# EAGLE design Trampoline_Light_Control_Breakout (EAGLE 6.5.0)
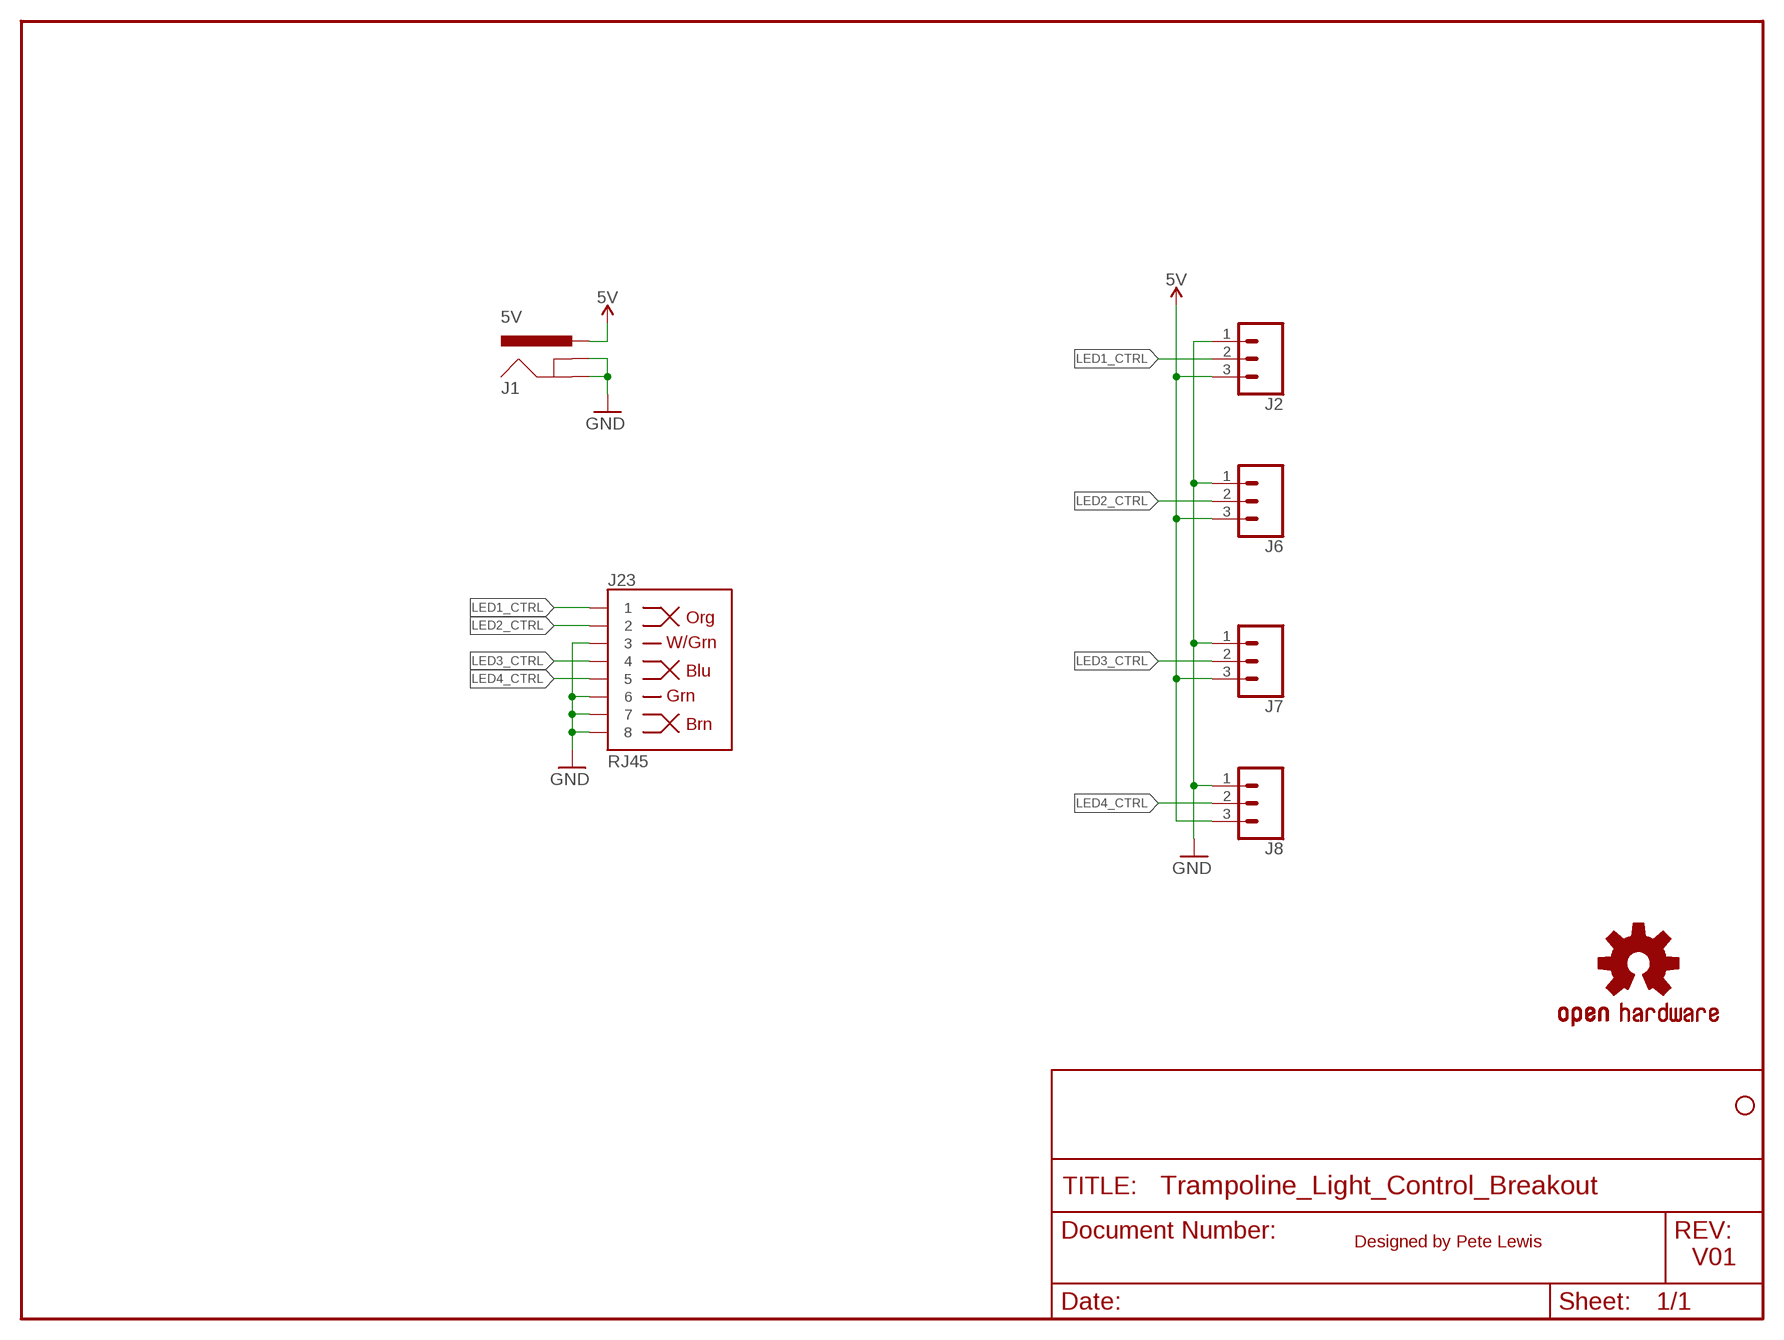
[diagram p0: schematic, sheet 1]

## Parts
J1  5V  POWER_JACKPTH_LOCK  [POWER_JACK_PTH_LOCK]
J2  CONN_03LONGPADS  [1X03_LONGPADS]
J6  CONN_03LONGPADS  [1X03_LONGPADS]
J7  CONN_03LONGPADS  [1X03_LONGPADS]
J8  CONN_03LONGPADS  [1X03_LONGPADS]
J23  RJ45  RJ45-8  [RJ45-8]
JP1  STAND-OFFTIGHTER  [STAND-OFF-TIGHTER]
LOGO2  OSHW-LOGOS  [OSHW-LOGO-S]

## Nets
GND: J1.GND J1.GNDBREAK J2.1 J6.1 J7.1 J8.1 J23.3 J23.6 J23.7 J23.8
LED1_CTRL [10_mil]: J2.2 J23.1
LED2_CTRL [10_mil]: J6.2 J23.2
LED3_CTRL [10_mil]: J7.2 J23.4
LED4_CTRL [10_mil]: J8.2 J23.5
VCC: J1.PWR J2.3 J6.3 J7.3 J8.3 ; supply symbol labelled 5V

## Notes on the sheet
- Designed by Pete Lewis
- V01

## Library data of the parts
J1 = SparkFun-Connectors:POWER_JACK: Power Jack Connector This is the standard 5.5mm barrel jack for power. The PTH is the most common, proven, reliable, footprint. The Slot footprint only works if the mill layer is transmitted to the PCB fab house so be warned. Here are the connectors we sell at SparkFun: DC Barrel Power Jack/Connector <https://www.sparkfun.com/products/119> (PRT-00119) DC Barrel Power Jack/Connector (SMD) <https://www.sparkfun.com/products/12748> (PRT-12748) DC Barrel Jack Adapter - Breadboard Compatible <https://www.sparkfun.com/products/10811> (PRT-10811) It is used on this SparkFun product (and many, many others): SparkFun RedBoard - Programmed with Arduino <https://www.sparkfun.com/products/12757> (DEV-12757) Also, if you need a mating power supply or connector, please check these out: Wall Adapter Power Supply - 9VDC 650mA <https://www.sparkfun.com/products/298> (TOL-00298) DC Barrel Jack Adapter - Male <https://www.sparkfun.com/products/10287> (PRT-10287); PROD_ID: CONN-08197; SF_ID: PRT-00119
J2 J6-J8 = SparkFun-Connectors:CONN_03: Multi connection point. Often used as Generic Header-pin footprint for 0.1 inch spaced/style header connections On any of the 0.1 inch spaced packages, you can populate with these: Break Away Headers - Straight <https://www.sparkfun.com/products/116> (PRT-00116) Break Away Male Headers - Right Angle <https://www.sparkfun.com/products/553> (PRT-00553) Female Headers <https://www.sparkfun.com/products/115> (PRT-00115) Break Away Headers - Machine Pin <https://www.sparkfun.com/products/117> (PRT-00117) Break Away Female Headers - Swiss Machine Pin <https://www.sparkfun.com/products/743> (PRT-00743) Stackable Header - 3 Pin (Female, 0.1") <https://www.sparkfun.com/products/13875> (PRT-13875) For SCREWTERMINALS and SPRING TERMINALS visit here: Screw Terimnals on SparkFun.com <https://www.sparkfun.com/search/results?term=Screw+Terminals> (5mm/3.5mm/2.54mm spacing) This device is also useful as a general connection point to wire up your design to another part of your project. Our various solder wires solder well into these plated through hole pads. Hook-Up Wire - Assortment (Stranded, 22 AWG) <https://www.sparkfun.com/products/11375> (PRT-11375) Hook-Up Wire - Assortment (Solid Core, 22 AWG) <https://www.sparkfun.com/products/11367> (PRT-11367) View the entire wire category on our website here <https://www.sparkfun.com/categories/141> Special notes: Molex polarized connector foot print use with SKU : PRT-08232 with associated crimp pins and housings.
J23 = SparkFun-Connectors:RJ45-8: RJ45 Jack - 8 pin Simple RJ45, 8-pin connection. Commonly used for Cat5, Cat5e, and Cat6 Ethernet cables. Here is the connector we sell at SparkFun: RJ45 8-Pin Connector <https://www.sparkfun.com/products/643> (PRT-00643) Datasheet <https://cdn.sparkfun.com/datasheets/Prototyping/04908.pdf> It is used on this SparkFun product: SparkFun RJ45 Breakout <https://www.sparkfun.com/products/716> (BOB-00716) Note, you may also be interested in the "MAGJACK" version of this. It is basically a RJ45 connector, but also has some status LEDs built into the connector housing. You can check that out in this library at the device named "MAGJACK.dev" and see these products online: RJ45 Ethernet MagJack-Compatible <https://www.sparkfun.com/products/8534> (PRT-08534) SparkFun RJ45 MagJack Breakout <https://www.sparkfun.com/products/13021> (BOB-13021); PROD_ID: CONN-08506; SF_ID: PRT-00643
JP1 = Testing:STAND-OFF: Stand Off This is the mechanical footprint for a #4 phillips button head screw. Use the keepout ring to avoid running the screw head into surrounding components. SKU : PRT-00447
LOGO2 = SparkFun-Aesthetics:OSHW-LOGO: Open-Source Hardware (OSHW) Logo This logo indicates the piece of hardware it is found on incorporates a OSHW license and/or adheres to the definition of open source hardware found here: http://freedomdefined.org/OSHW

## Net classes
1 8_mil: width 0.203 mm
2 10_mil: width 0.254 mm
3 12_mil: width 0.305 mm
4 15_mil: width 0.381 mm
5 20_mil: width 0.508 mm
6 25_mil: width 0.635 mm
7 30_mil: width 0.762 mm

## Board
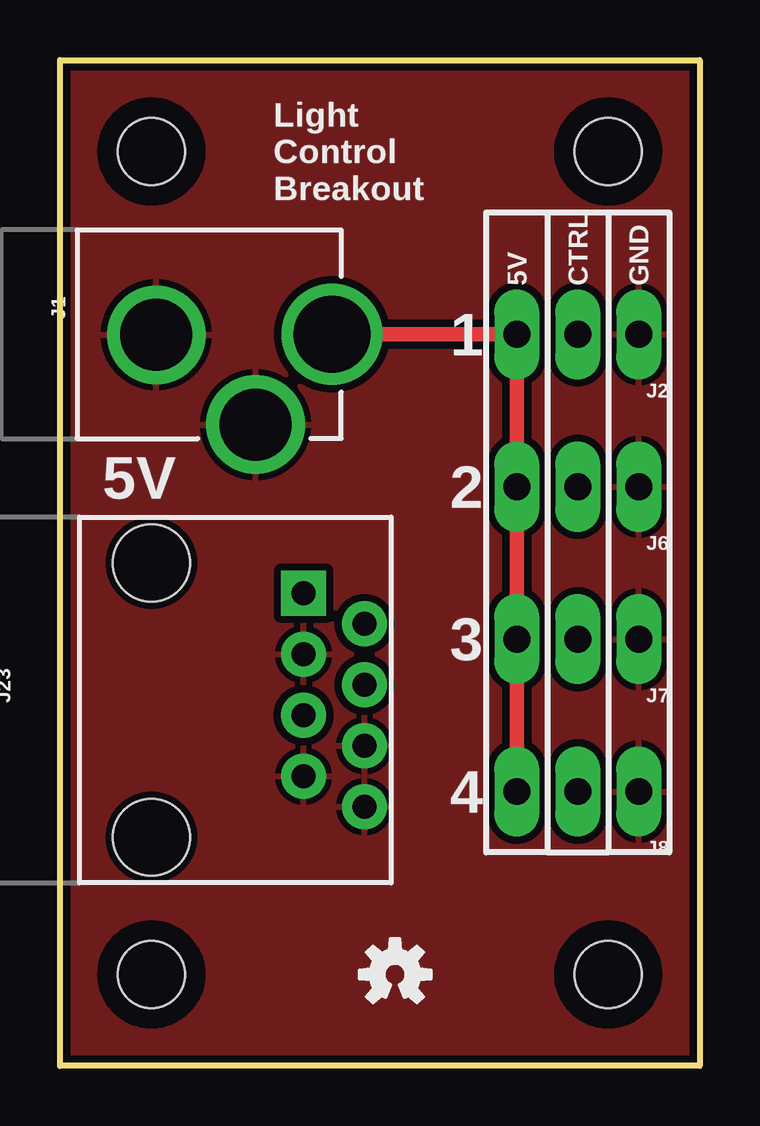
[diagram p1: board, top side]
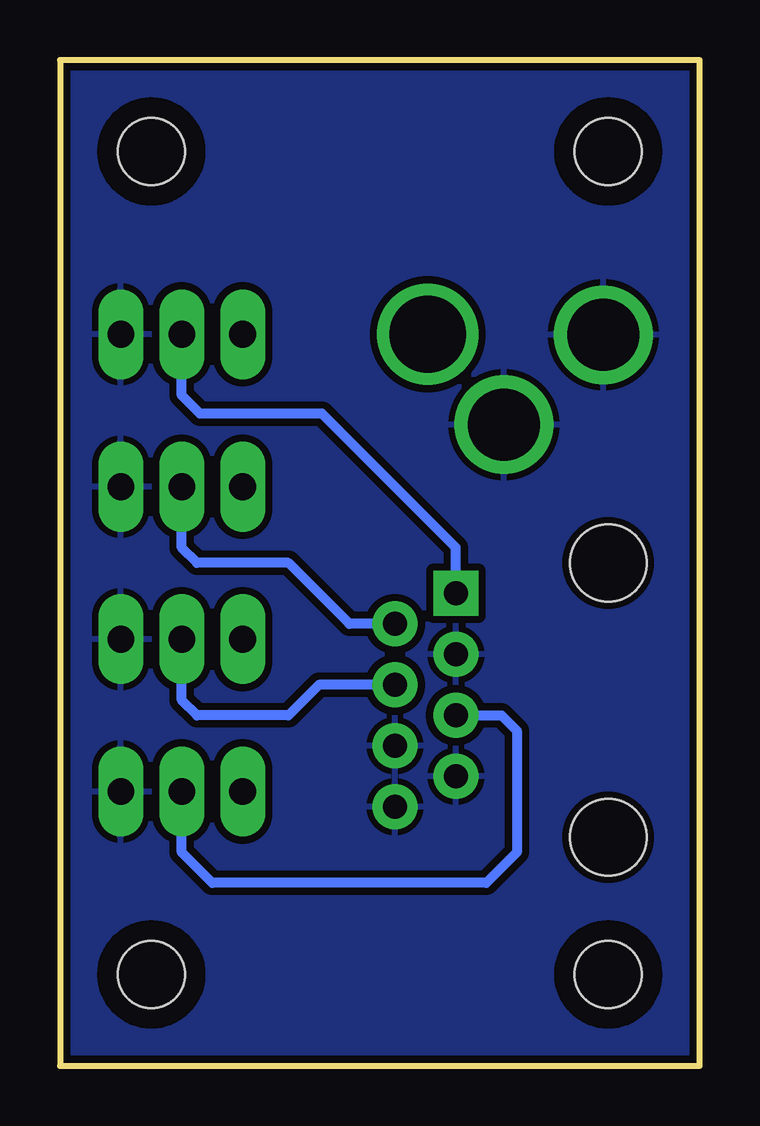
[diagram p2: board, bottom side, seen from below]

Size 26.67 x 41.91 mm. Coordinates in mm from the lower left corner, seen from the top.
Outline: 0,0 0,41.91 26.67,41.91 26.67,0 0,0
Copper layers (1*16): Top 0.035mm / dielectric 1.5mm / Bottom 0.035mm
Design rules "SparkFun-2-layer-STANDARD *": minimum track width 8mil, minimum drill 20mil, track to track 10mil, track to pad 8mil, pad to pad 8mil, via to via 10mil, smd to smd 8mil, copper to edge 8mil, drill to drill 8mil, minimum pad ring 10mil, minimum via ring 10mil, stop-mask expansion 4mil, vias tented up to drill 25mil, thermal gap 10mil

### Footprints (pad centres in the part's own frame; a part is rotated, then mirrored left to right if it is on the bottom)
POWER_JACK_PTH_LOCK = drill 2.997 pad 4.115: GND 0.025,6.557; GNDBREAK 3.762,10.7 | drill 3.2 pad 4.115: PWR 0,13.878
1X03_LONGPADS = drill 1.118 pad 1.88 long: 1 0,0; 2 2.54,0; 3 5.08,0
RJ45-8 = drill 1 pad 1.88 square: 1 -4.445,6.35 | drill 1 pad 1.88: 2 -3.175,8.89; 3 -1.905,6.35; 4 -0.635,8.89; 5 0.635,6.35; 6 1.905,8.89; 7 3.175,6.35; 8 4.445,8.89 | hole 3.2: -5.715,0; 5.715,0
STAND-OFF-TIGHTER = hole 2.794: 0,0

### Placement (x,y rotation side)
J1  -2.54,30.48 270 top
J2  24.13,30.48 180 top
J6  24.13,24.13 180 top
J7  24.13,17.78 180 top
J8  24.13,11.43 180 top
J23  3.81,15.24 270 top
JP1  22.86,38.1 0 top
JP2  STAND-OFFTIGHTER  [STAND-OFF-TIGHTER]  22.86,3.81 0 top
JP3  STAND-OFFTIGHTER  [STAND-OFF-TIGHTER]  3.81,3.81 0 top
JP7  STAND-OFFTIGHTER  [STAND-OFF-TIGHTER]  3.81,38.1 0 top
LOGO2  13.97,3.81 0 top

### Tracks (layer width: path | path; a pad name or v marks a point on that pad's centre or on a via)
GND
  pour Bottom (isolate 0.305): 0,0 0,41.91 26.67,41.91 26.67,0
  pour Top (isolate 0.305): 0,0 0,41.91 26.67,41.91 26.67,0
LED1_CTRL
  Bottom 0.406: J23.1 10.16,21.59 15.75,27.18 20.83,27.18 21.59,27.94 J2.2
LED2_CTRL
  Bottom 0.406: J23.2 14.61,18.41 17.14,20.95 20.95,20.95 21.59,21.59 J6.2
LED3_CTRL
  Bottom 0.406: J23.4 15.88,15.88 17.14,14.61 20.95,14.61 21.59,15.24 J7.2
LED4_CTRL
  Bottom 0.406: J23.5 8.26,14.61 7.62,13.97 7.62,8.89 8.89,7.62 20.32,7.62 21.59,8.89 J8.2
VCC
  Top 0.61: J1.PWR J2.3 J6.3 J7.3 J8.3

### Text on the board
tPlace: Light / Control / Breakout | 5V | CTRL | GND | 1 | 5V | 2 | 3 | 4